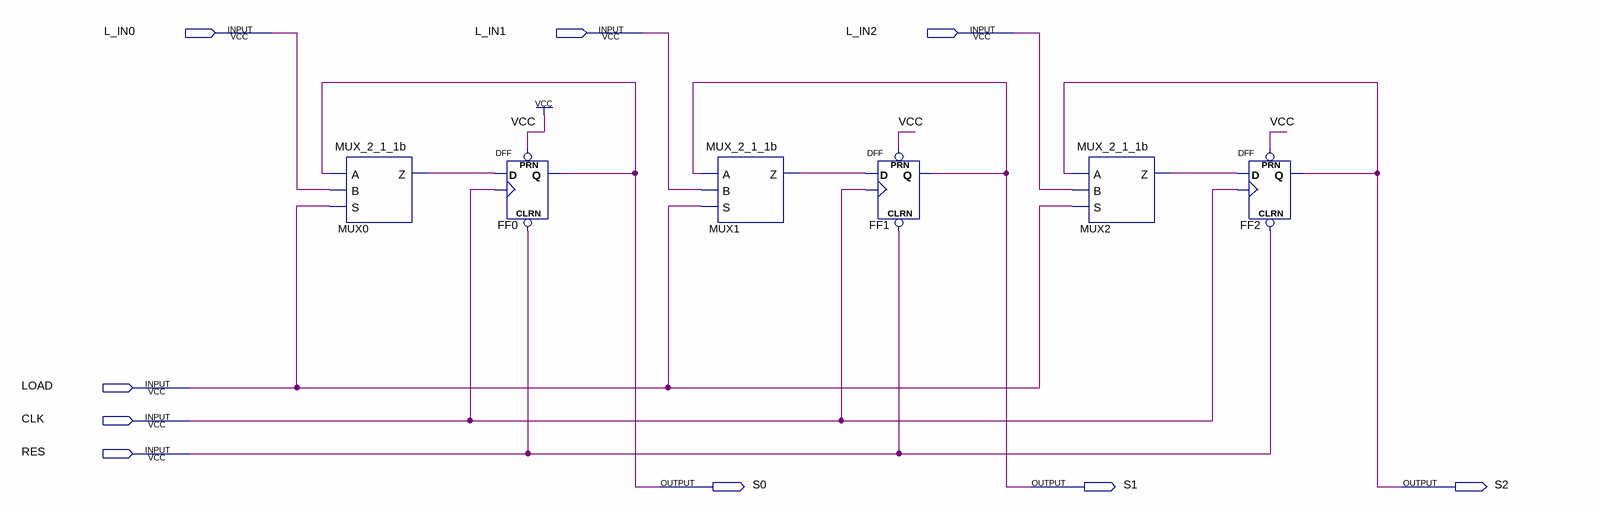
[diagram p0: schematic sheet]
// Quartus schematic REG_3b.bdf as structural Verilog: 6 symbols, 9 pins
module REG_3b (
  input  L_IN0,
  input  L_IN1,
  input  L_IN2,
  input  LOAD,
  input  CLK,
  input  RES,
  output S0,
  output S1,
  output S2
);

  wire MUX0_z, MUX1_z, MUX2_z;

  MUX_2_1_1b MUX0 (.A(S0), .B(L_IN0), .S(LOAD), .Z(MUX0_z));
  DFF FF0 (.CLRN(RES), .CLK(CLK), .D(MUX0_z), .PRN(1'b1), .Q(S0));
  MUX_2_1_1b MUX1 (.A(S1), .B(L_IN1), .S(LOAD), .Z(MUX1_z));
  DFF FF1 (.CLRN(RES), .CLK(CLK), .D(MUX1_z), .PRN(1'b1), .Q(S1));
  MUX_2_1_1b MUX2 (.A(S2), .B(L_IN2), .S(LOAD), .Z(MUX2_z));
  DFF FF2 (.CLRN(RES), .CLK(CLK), .D(MUX2_z), .PRN(1'b1), .Q(S2));
endmodule
